# EAGLE design Tomo (EAGLE 6.5.0)
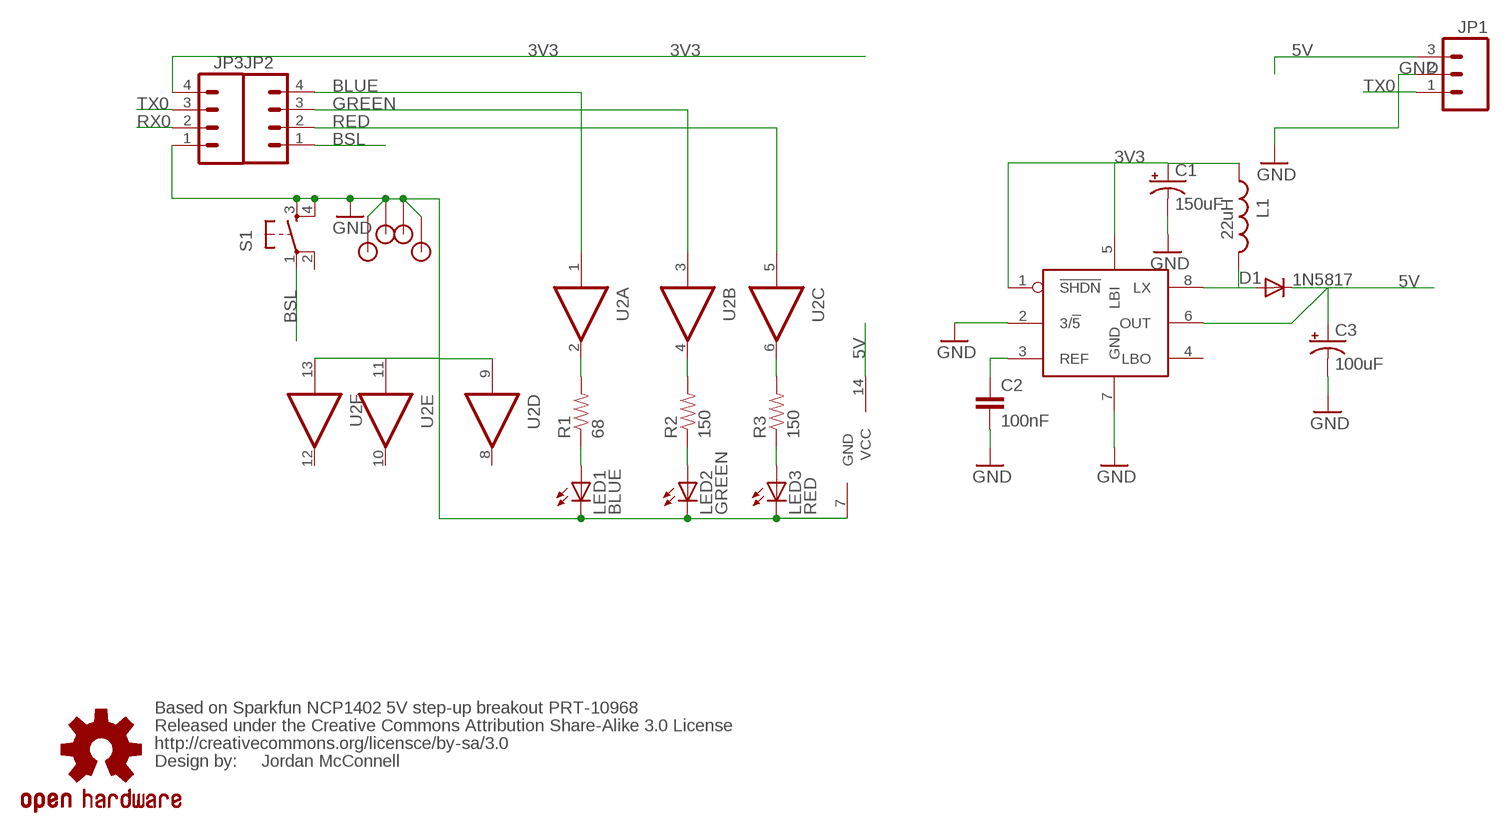
[diagram p0: schematic, sheet 1]

## Parts
C1  150uF  CAP_POLPTH1  [CPOL-RADIAL-100UF-25V]
C2  100nF  CAPPTH  [CAP-PTH-SMALL]
C3  100uF  CAP_POLPTH1  [CPOL-RADIAL-100UF-25V]
D1  1N5817  DIODE1N4148  [DIODE-1N4148]
JP1  M03PTH  [1X03]
JP2  M04PTH  [1X04]
JP3  M04PTH  [1X04]
L1  22uH  INDUCTORRCH-895  [RADIAL_5MM]
LED1  BLUE  LED5MM  [LED5MM]
LED2  GREEN  LED5MM  [LED5MM]
LED3  RED  LED5MM  [LED5MM]
R1  68  RESISTORAXIAL-0.3  [AXIAL-0.3]
R2  150  RESISTORAXIAL-0.3  [AXIAL-0.3]
R3  150  RESISTORAXIAL-0.3  [AXIAL-0.3]
S1  TAC_SWITCHPTH  [TACTILE-PTH]
U2  741034  [DIL-14]
U$1  OSHW-LOGOL  [OSHW-LOGO-L]
U$2  MAX756  [DIL-8]
U$3  STANDOFF  [STANDOFF]
U$4  STANDOFF  [STANDOFF]
U$5  STANDOFF  [STANDOFF]
U$6  STANDOFF  [STANDOFF]

## Nets
3V3 [pwr]: C1.1(+) JP3.4 L1.1 U$2.1(!SHDN) U$2.5(LBI)
5V [pwr]: C3.1(+) D1.C JP1.3 U2.14(VCC) U$2.6(OUT)
BLUE: JP2.4 U2.1(A:IN)
BSL: JP2.1 S1.1
GND [pwr]: C1.2(-) C2.2 C3.2(-) JP1.2 JP3.1 LED1.K(C) LED2.K(C) LED3.K(C) S1.3 S1.4 U2.7(GND) U2.9(D:IN) U2.11(E:IN) U2.13(F:IN) U$2.2(3/!5) U$2.7(GND) U$3.P$1 U$4.P$1 U$5.P$1 U$6.P$1
GREEN: JP2.3 U2.3(B:IN)
N$1 [pwr]: LED1.A R1.P$1
N$2 [pwr]: LED2.A R2.P$1
N$3 [pwr]: D1.A L1.2 U$2.8(LX)
N$4 [pwr]: LED3.A R3.P$1
N$5 [pwr]: R1.P$2 U2.2(A:OUT)
N$6 [pwr]: R2.P$2 U2.4(B:OUT)
N$7 [pwr]: R3.P$2 U2.6(C:OUT)
N$8: C2.1 U$2.3(REF)
RED: JP2.2 U2.5(C:IN)
RX0: JP3.2
TX0: JP1.1 JP3.3
Unconnected: S1.2 U2.8(D:OUT) U2.10(E:OUT) U2.12(F:OUT) U$2.4(LBO)

## Notes on the sheet
- Based on Sparkfun NCP1402 5V step-up breakout PRT-10968
- Released under the Creative Commons Attribution Share-Alike 3.0 License
- http://creativecommons.org/licensce/by-sa/3.0
- Design by: | Jordan McConnell

## Library data of the parts
C1 C3 = SparkFun-Capacitors:CAP_POL: Capacitor Polarized These are standard SMD and PTH capacitors. Normally 10uF, 47uF, and 100uF in electrolytic and tantalum varieties. Always verify the external diameter of the through hole cap, it varies with capacity, voltage, and manufacturer. The EIA devices should be standard.; DIGIKEY: 445-1387-1-ND
C2 = SparkFun-Capacitors:CAP: Capacitor Standard 0603 ceramic capacitor, and 0.1" leaded capacitor.
D1 = SparkFun-DiscreteSemi:DIODE: Diode These are standard reverse protection diodes and small signal diodes. SMA package can handle up to about 1A. SOD-323 can handle about 200mA. What the SOD-323 package when ordering, there are some mfgs out there that are 5-pin packages.; DIGIKEY: MBRA140T3GOSCT-ND
JP1 = SparkFun-Connectors:M03: Header 3 Standard 3-pin 0.1" header. Use with straight break away headers (SKU : PRT-00116), right angle break away headers (PRT-00553), swiss pins (PRT-00743), machine pins (PRT-00117), and female headers (PRT-00115). Molex polarized connector foot print use with SKU : PRT-08232 with associated crimp pins and housings.; DIGIKEY: $NOPART
JP2 JP3 = SparkFun-Connectors:M04: Header 4 Standard 4-pin 0.1" header. Use with straight break away headers (SKU : PRT-00116), right angle break away headers (PRT-00553), swiss pins (PRT-00743), machine pins (PRT-00117), and female headers (PRT-00115). Molex polarized connector foot print use with SKU : PRT-08231 with associated crimp pins and housings. 1MM SMD Version SKU: PRT-10208; DIGIKEY: $NOPART
L1 = KwanSystems:INDUCTOR; DIGIKEY: 308-2116-ND
LED1 = SparkFun-LED:LED: LEDs Standard schematic elements and footprints for 5mm, 3mm, 1206, and 0603 sized LEDs. 5mm - Spark Fun Electronics SKU : COM-00529 (and others); DIGIKEY: 67-1751-ND
LED2 = SparkFun-LED:LED: LEDs Standard schematic elements and footprints for 5mm, 3mm, 1206, and 0603 sized LEDs. 5mm - Spark Fun Electronics SKU : COM-00529 (and others); DIGIKEY: 160-1684-ND
LED3 = SparkFun-LED:LED: LEDs Standard schematic elements and footprints for 5mm, 3mm, 1206, and 0603 sized LEDs. 5mm - Spark Fun Electronics SKU : COM-00529 (and others); DIGIKEY: 754-1277-ND
R1 = SparkFun-Passives:RESISTOR: Resistor Basic schematic elements and footprints for 0603, 1206, and PTH resistors.; DIGIKEY: CF14JT68R0CT-ND
R2 R3 = SparkFun-Passives:RESISTOR: Resistor Basic schematic elements and footprints for 0603, 1206, and PTH resistors.; DIGIKEY: CF14JT150RCT-ND
S1 = SparkFun-Electromechanical:TAC_SWITCH: Momentary Switch Button commonly used for reset or general input. Spark Fun Electronics SKU : COM-00097 SMT- SWCH-08247
U2 = KwanSystems:741034: Hex Driver, Non-inverting SN74AS1034 is capable of 48mA source/sink Digikey 296-33790-5-ND; DIGIKEY: 296-33703-5-ND
U$1 = SparkFun-Aesthetics:OSHW-LOGO: Open Source Hardware Logo This logo indicates the piece of hardware it is found on incorporates a OSHW license and/or adheres to the definition of open source hardware found here: http://freedomdefined.org/OSHW; DIGIKEY: $NOPART
U$2 = KwanSystems:MAX756
U$3-U$6 = KwanSystems:STANDOFF; DIGIKEY: $NOPART

## Net classes
0 default: width 0.152 mm, drill 0.33 mm, clearance 0.152 mm
1 pwr: width 0.406 mm, drill 0.33 mm, clearance 0.152 mm

## Board
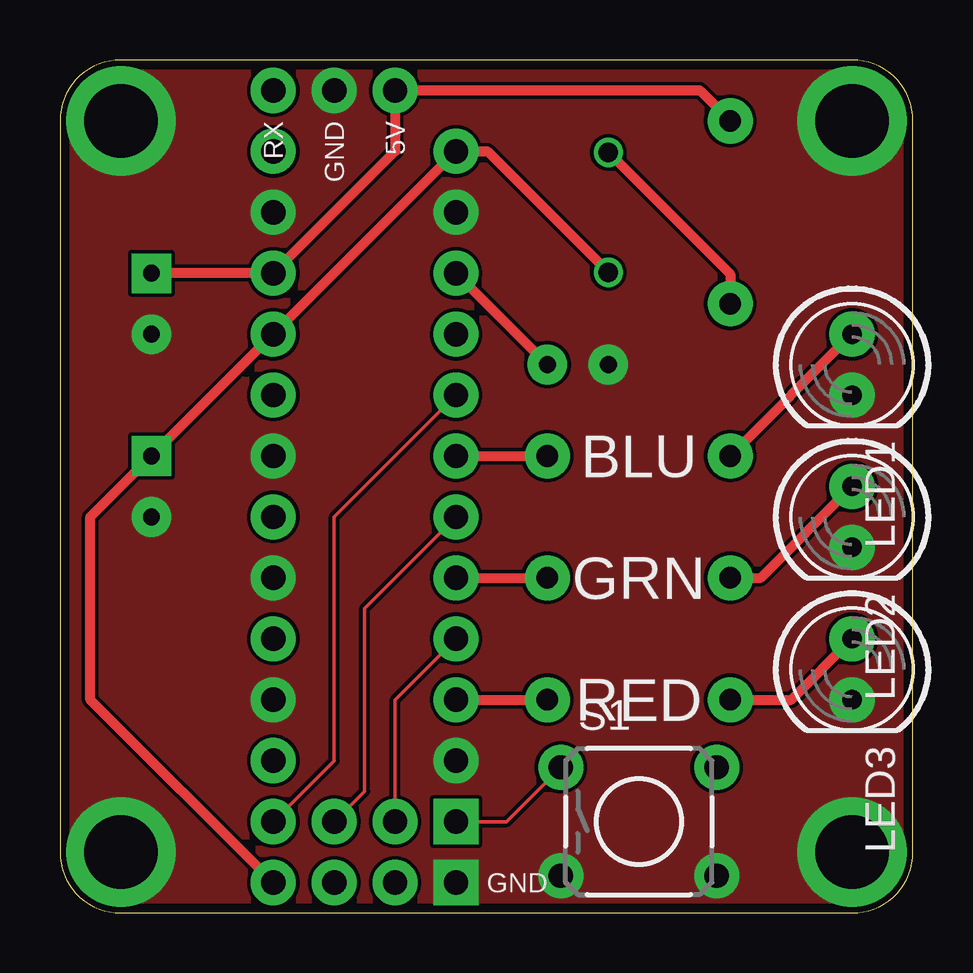
[diagram p1: board, top side]
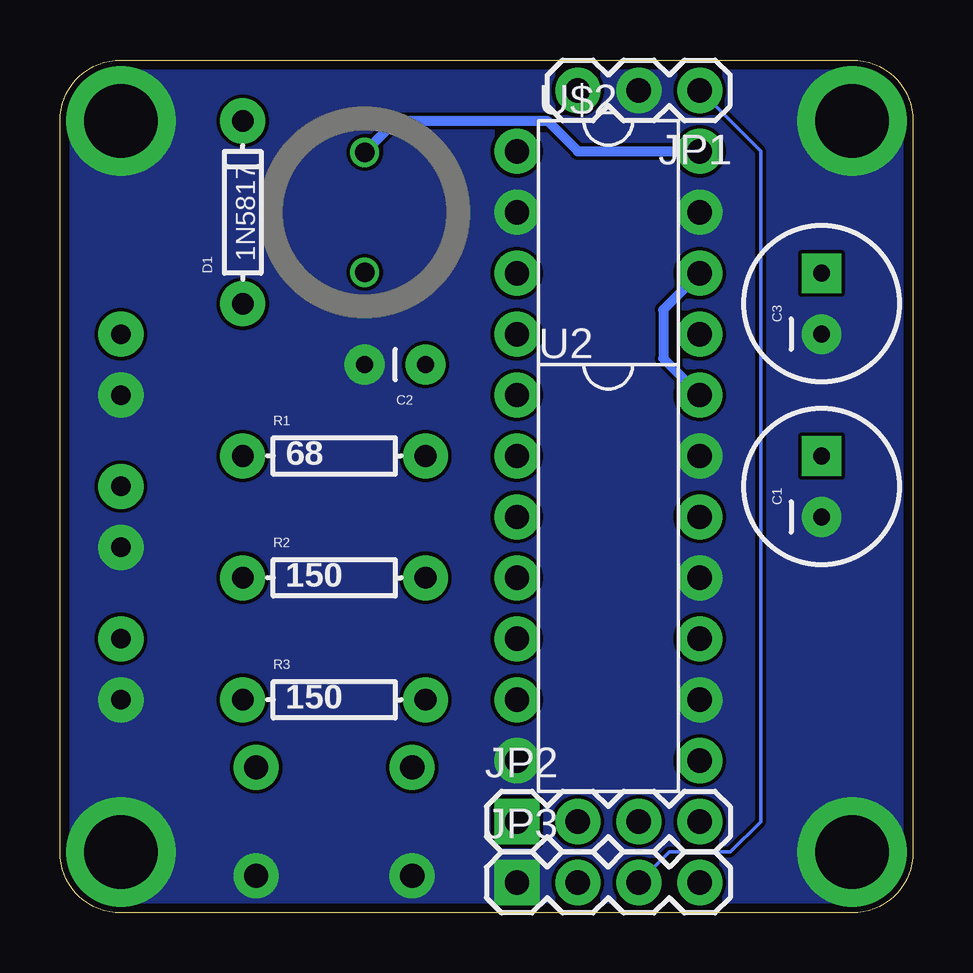
[diagram p2: board, bottom side, seen from below]

Size 35.56 x 35.56 mm. Coordinates in mm from the lower left corner, seen from the top.
Outline: 2.54,0 33.02,0 arc90 35.56,2.54 35.56,33.02 arc90 33.02,35.56 2.54,35.56 arc90 0,33.02 0,2.54 arc90 2.54,0
Copper layers (1*16): Top 0.0356mm / dielectric 1.5011mm / Bottom 0.0356mm
Design rules "LaenPCBOrder": minimum track width 6mil, minimum drill 13mil, track to track 6mil, track to pad 6mil, pad to pad 6mil, via to via 6mil, smd to smd 6mil, copper to edge 15mil, drill to drill 6mil, minimum pad ring 7mil, minimum via ring 7mil, stop-mask expansion 4mil, vias tented up to drill 0mil, thermal gap 10mil

### Footprints (pad centres in the part's own frame; a part is rotated, then mirrored left to right if it is on the bottom)
CPOL-RADIAL-100UF-25V = drill 0.7 pad 1.651 square: 1 1.27,0 | drill 0.7 pad 1.651: 2 -1.27,0
CAP-PTH-SMALL = drill 0.7 pad 1.651: 1 0,0; 2 2.54,0
DIODE-1N4148 = drill 0.9 pad 1.88: A -3.81,0; C 3.81,0
1X03 = drill 1.016 pad 1.88: 1 0,0; 2 2.54,0; 3 5.08,0
1X04 = drill 1.016 pad 1.88 square: 1 0,0 | drill 1.016 pad 1.88: 2 2.54,0; 3 5.08,0; 4 7.62,0
RADIAL_5MM = drill 0.813: 1 0,-2.5; 2 0,2.5
LED5MM = drill 0.813 pad 1.88: A -1.27,0; K 1.27,0
AXIAL-0.3 = drill 0.9 pad 1.88: P$1 -3.81,0; P$2 3.81,0
TACTILE-PTH = drill 1.016 pad 1.88: 1 -3.251,2.261; 2 3.251,2.261; 3 -3.251,-2.261; 4 3.251,-2.261
DIL-14 = drill 1.016 pad 1.88: 1 -7.62,-3.81; 2 -5.08,-3.81; 3 -2.54,-3.81; 4 0,-3.81; 5 2.54,-3.81; 6 5.08,-3.81; 7 7.62,-3.81; 8 7.62,3.81; 9 5.08,3.81; 10 2.54,3.81; 11 0,3.81; 12 -2.54,3.81; 13 -5.08,3.81; 14 -7.62,3.81
DIL-8 = drill 1.016 pad 1.88: 1 -3.81,-3.81; 2 -1.27,-3.81; 3 1.27,-3.81; 4 3.81,-3.81; 5 3.81,3.81; 6 1.27,3.81; 7 -1.27,3.81; 8 -3.81,3.81
STANDOFF = drill 3.048 pad 4.572: P$1 0,0

### Placement (x,y rotation side)
C1  3.81,17.78 90 bottom
C2  20.32,22.86 180 bottom
C3  3.81,25.4 90 bottom
D1  27.94,29.21 90 bottom
JP1  8.89,34.29 180 bottom
JP2  16.51,3.81 0 bottom
JP3  16.51,1.27 0 bottom
L1  22.86,29.21 0 bottom
LED1  33.02,22.86 270 top
LED2  33.02,16.51 270 top
LED3  33.02,10.16 270 top
R1  24.13,19.05 0 bottom
R2  24.13,13.97 0 bottom
R3  24.13,8.89 0 bottom
S1  24.13,3.81 0 top
U2  12.7,13.97 270 bottom
U$1  52.07,34.29 0 top  (outside the outline)
U$2  12.7,27.94 270 bottom
U$3  2.54,2.54 0 top
U$4  2.54,33.02 0 top
U$5  33.02,2.54 0 top
U$6  33.02,33.02 0 top
U$7  [KWAN_CIRCLE]  42.42,34.29 0 top  (outside the outline)

### Tracks (layer width: path | path; a pad name or v marks a point on that pad's centre or on a via)
3V3
  Top 0.406: JP3.4 1.27,8.89 1.27,16.51 C1.1 U$2.5 U$2.1 17.82,31.75 L1.1
5V
  Top 0.406: C3.1 U$2.6 13.97,31.75 JP1.3 26.67,34.29 D1.C
  Bottom 0.406: U$2.6 10.41,25.15 10.41,23.11 U2.14
BLUE
  Top 0.152: JP2.4 11.43,6.35 11.43,16.51 U2.1
BSL
  Top 0.152: JP2.1 18.62,3.81 S1.1
GND
  pour Top (no thermals): 2.54,0 33.02,0 35.56,0 35.56,2.54 35.56,33.02 33.02,33.02 33.02,35.56 2.54,35.56 0,35.56 0,33.02 0,2.54 2.54,2.54
  pour Bottom (no thermals): 2.54,0 33.02,0 35.56,0 35.56,2.54 35.56,33.02 33.02,33.02 33.02,35.56 2.54,35.56 0,35.56 0,33.02 0,2.54 2.54,2.54
GREEN
  Top 0.152: JP2.3 12.7,5.08 12.7,12.7 U2.3
N$1
  Top 0.406: R1.P$1 LED1.A
N$2
  Top 0.406: R2.P$1 29.21,13.97 LED2.A
N$3
  Top 0.406: L1.2 27.94,26.63 D1.A
  Bottom 0.406: U$2.8 13.97,31.75 15.24,33.02 21.55,33.02 L1.2
N$4
  Top 0.406: R3.P$1 30.48,8.89 LED3.A
N$5
  Top 0.406: U2.2 R1.P$2
N$6
  Top 0.406: U2.4 R2.P$2
N$7
  Top 0.406: U2.6 R3.P$2
N$8
  Top 0.406: U$2.3 C2.1
RED
  Top 0.152: JP2.2 13.97,8.89 U2.5
TX0
  Bottom 0.152: JP1.1 6.35,31.75 6.35,3.81 7.62,2.54 10.16,2.54 JP3.3

### Text on the board
tPlace: RX | GND | 5V | stkwans.blogspot.com | Project Yukari 3 | Board Tomo | BLU | GRN | RED | GND
bPlace: a division of Kwan Systems | the Terminally ADD | St Kwan's Home for